# Altium schematic sheet ProgrammableGainAmplifier.SchDoc: Programmable Gain Amplifier
size A4; DrawnBy: Patrik Staudenmayer; DocumentNumber: 13; SheetNumber: 13; SheetTotal: 15
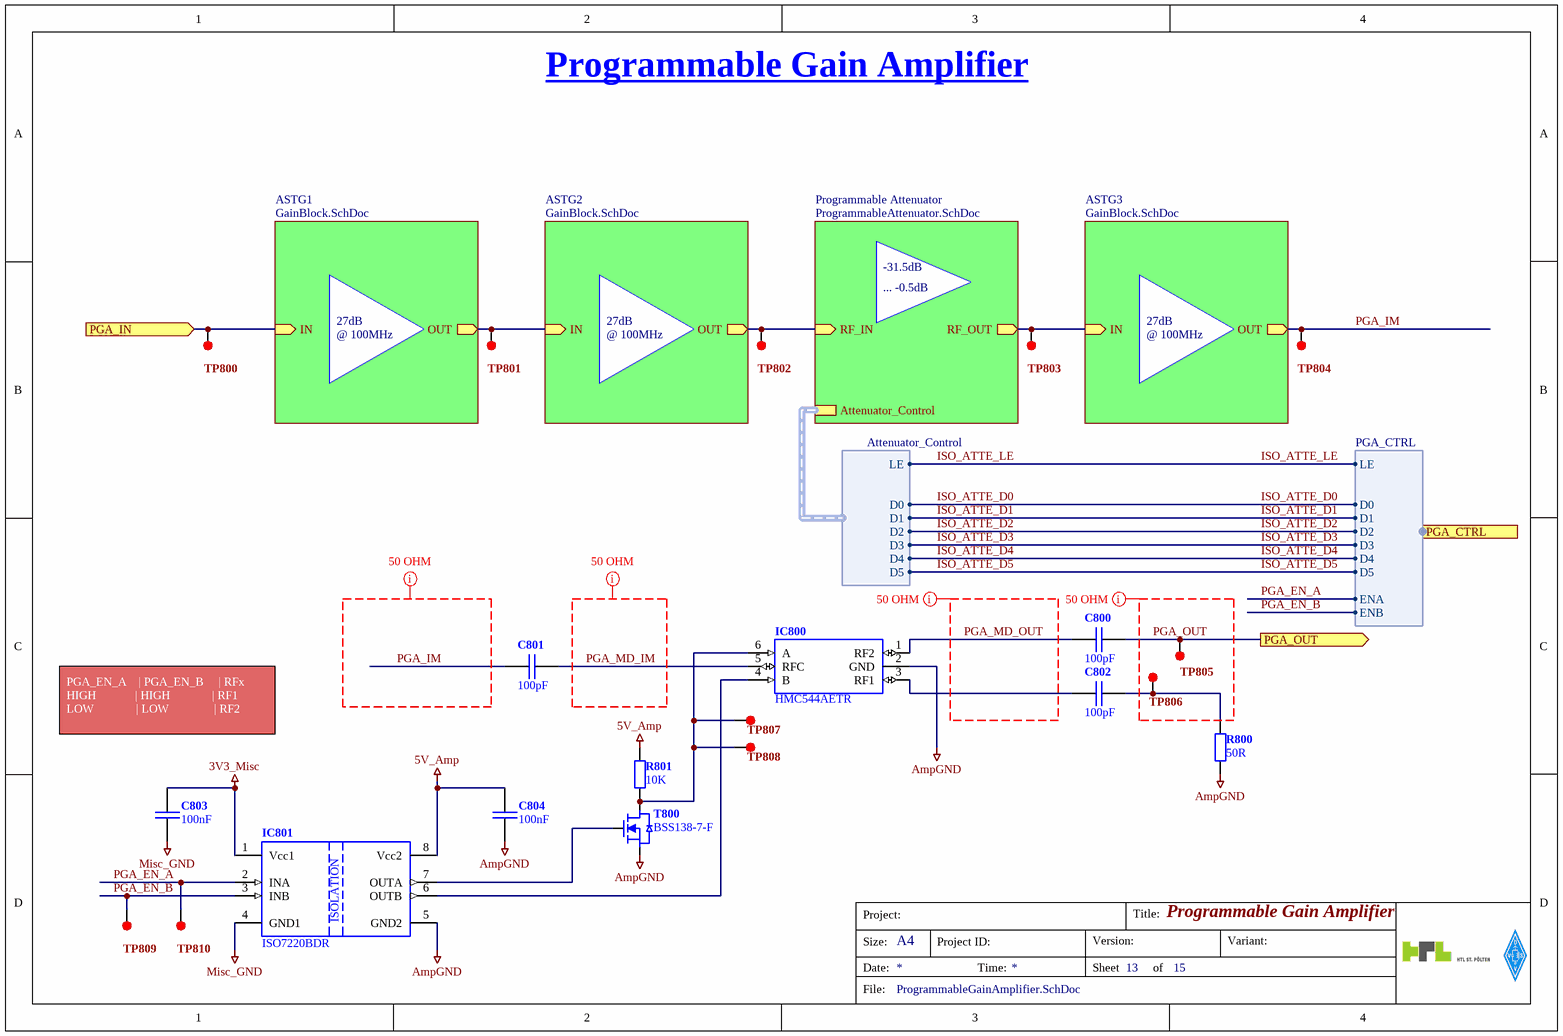
[diagram p0: ProgrammableGainAmplifier.SchDoc]

## Parts
C800  100pF  [C_0603_N [CAPC1608N IPC]]
C801  100pF  [C_0603_N [CAPC1608N IPC]]
C802  100pF  [C_0603_N [CAPC1608N IPC]]
C803  100nF  [C_0603_N [CAPC1608N IPC]]
C804  100nF  [C_0603_N [CAPC1608N IPC]]
IC800  HMC544AETR  [TSOP95P280X145-6N IPC]
IC801  ISO7220BDR  [SOIC127P600X175-8N IPC]
R800  50R  [R_1206_N [RESC3216N IPC]]
R801  10K  [R_0603_N [RESC1608N IPC]]
T800  BSS138-7-F  [SOT105P235X102-3N IPC]
TP800  TP_GENERIC  [TP_0.8_P100T]  (value not drawn)  (no BOM)
TP801  TP_GENERIC  [TP_0.8_P100T]  (value not drawn)  (no BOM)
TP802  TP_GENERIC  [TP_0.8_P100T]  (value not drawn)  (no BOM)
TP803  TP_GENERIC  [TP_0.8_P100T]  (value not drawn)  (no BOM)
TP804  TP_GENERIC  [TP_0.8_P100T]  (value not drawn)  (no BOM)
TP805  TP_GENERIC  [TP_0.8_P100T]  (value not drawn)  (no BOM)
TP806  TP_GENERIC  [TP_0.8_P100T]  (value not drawn)  (no BOM)
TP807  TP_GENERIC  [TP_0.8_P100T]  (value not drawn)  (no BOM)
TP808  TP_GENERIC  [TP_0.8_P100T]  (value not drawn)  (no BOM)
TP809  TP_GENERIC  [TP_0.8_P100T]  (value not drawn)  (no BOM)
TP810  TP_GENERIC  [TP_0.8_P100T]  (value not drawn)  (no BOM)

## Sub-sheets
ASTG1 = GainBlock.SchDoc: OUT (out), IN (in)
ASTG2 = GainBlock.SchDoc: OUT (out), IN (in)
ASTG3 = GainBlock.SchDoc: OUT (out), IN (in)
Programmable Attenuator = ProgrammableAttenuator.SchDoc: RF_IN (in), RF_OUT (out), Attenuator_Control (harness Attenuator_Control)

## Ports
PGA_CTRL (harness PGA_CTRL), PGA_IN (in), PGA_OUT (out)

## Harnesses
Attenuator_Control: LE, D0, D1, D2, D3, D4, D5
PGA_CTRL: LE, D0, D1, D2, D3, D4, D5, ENA, ENB

## Nets
3V3_Misc: C803.1 IC801.1(Vcc1)
5V_Amp: C804.1 IC801.8(Vcc2) R801.2
AmpGND: C804.2 IC800.2(GND) IC801.5(GND2) R800.1 T800.S
Misc_GND: C803.2 IC801.4(GND1)
ISO_ATTE_D0: sheet Programmable Attenuator/Attenuator_Control.D0, port PGA_CTRL.D0
ISO_ATTE_D1: sheet Programmable Attenuator/Attenuator_Control.D1, port PGA_CTRL.D1
ISO_ATTE_D2: sheet Programmable Attenuator/Attenuator_Control.D2, port PGA_CTRL.D2
ISO_ATTE_D3: sheet Programmable Attenuator/Attenuator_Control.D3, port PGA_CTRL.D3
ISO_ATTE_D4: sheet Programmable Attenuator/Attenuator_Control.D4, port PGA_CTRL.D4
ISO_ATTE_D5: sheet Programmable Attenuator/Attenuator_Control.D5, port PGA_CTRL.D5
ISO_ATTE_LE: sheet Programmable Attenuator/Attenuator_Control.LE, port PGA_CTRL.LE
PGA_EN_A: IC801.2(INA) TP810.1 ; port PGA_CTRL.ENA
PGA_EN_B: IC801.3(INB) TP809.1 ; port PGA_CTRL.ENB
PGA_IM: C801.1 TP804.1 ; sheet ASTG3/OUT
PGA_IN: TP800.1 ; port PGA_IN, sheet ASTG1/IN
PGA_MD_IM: C801.2 IC800.5(RFC)
PGA_MD_OUT: C800.1 IC800.1(RF2)
PGA_OUT: C800.2 TP805.1 ; port PGA_OUT
NetC802_1: C802.1 IC800.3(RF1)
NetC802_2: C802.2 R800.2 TP806.1
NetIC800_4: IC800.4(B) IC801.6(OUTB)
NetIC800_6: IC800.6(A) R801.1 T800.D TP807.1 TP808.1
NetIC801_7: IC801.7(OUTA) T800.G
NetTP801_1: TP801.1 ; sheet ASTG1/OUT, sheet ASTG2/IN
NetTP802_1: TP802.1 ; sheet ASTG2/OUT, sheet Programmable Attenuator/RF_IN
NetTP803_1: TP803.1 ; sheet ASTG3/IN, sheet Programmable Attenuator/RF_OUT

## Layout directives
rule Width Constraint [Pref Impedance = 50.00ohms    Min Impedance = 50.00ohms    Max Impedance = 50.00ohms]; rule Maximum Via Count Constraint [Max Count = 2]: PGA_IM, PGA_MD_IM, PGA_MD_OUT, PGA_OUT

## Notes on the sheet
- -31.5dB
- ... -0.5dB
- 27dB
- @ 100MHz
- PGA_EN_A    | PGA_EN_B     | RFx
  HIGH             | HIGH              | RF1
  LOW              | LOW               | RF2
- Project:
- Title:
- Size:
- Date:
- A4
- Project ID:
- Time:
- Sheet
- Version:
- of
- Variant:
- File:
- (in symbol IC_ISO7220BDR) ISOLATION

## Library data of the parts
C800-C802 = C_GENERIC: Prometheus_Manufacturer: AVX Corporation; Prometheus_ID: *; Prometheus_ManPartNo: =06031U101FAT2A; Prometheus_Comment: 100pF; Prometheus_CurrentFootprint: C_0603_N [CAPC1608N IPC]
C803 C804 = C_GENERIC: Prometheus_ID: *; Prometheus_ManPartNo: 100nF; Prometheus_Manufacturer: *; Prometheus_Comment: 100nF; Prometheus_CurrentFootprint: C_0603_N [CAPC1608N IPC]
IC800 = IC_HMC544AETR: GaAS MMIC T/R Switch / DC ... 4 GHz / Insetion Loss: 0.2 dB @ 1 GHz / P1dB: +39 dBm / IP3: +60 dBm / Control: 3 V / 5 V; Prometheus_Manufacturer: Analog Devices; Prometheus_ManPartNo: HMC544AETR; Prometheus_Comment: HMC544AETR; Prometheus_CurrentFootprint: TSOP95P280X145-6N IPC; DatasheetURL: https://www.analog.com/media/en/technical-documentation/data-sheets/hmc544ae.pdf
IC801 = IC_ISO7220BDR: Dual-Channel Digital Isolator / Vcc: 3V3 or 5 V Supply / 4 kV ESD protection; Prometheus_Manufacturer: Texas Instruments; Prometheus_ManPartNo: ISO7220BDR; Prometheus_Comment: ISO7220BDR; Prometheus_CurrentFootprint: SOIC127P600X175-8N IPC; DatasheetURL: https://www.ti.com/lit/ds/symlink/iso7220a.pdf
R800 R801 = R_GENERIC_DIN: Prometheus_ID: *; Prometheus_Manufacturer: *
  R800: Prometheus_ManPartNo: 50R; Prometheus_Comment: 50R; Prometheus_CurrentFootprint: R_1206_N [RESC3216N IPC]
  R801: Prometheus_ManPartNo: 10K; Prometheus_Comment: 10K; Prometheus_CurrentFootprint: R_0603_N [RESC1608N IPC]
T800 = T_NMOS_BSS138-7-F: VDS = 50 V / VDG = 50 V / VGS = +-20 V / ID = 200 mA / VGS_th = typ. 1.2 V / RDS_on = typ. 1.4 OHM; Prometheus_Manufacturer: Diodes Incorporated; Prometheus_ID: *; Prometheus_ManPartNo: BSS138-7-F; Prometheus_Comment: BSS138-7-F; Prometheus_CurrentFootprint: SOT105P235X102-3N IPC; ComponentLink1Description: Datasheet; ComponentLink1URL: https://www.diodes.com/assets/Datasheets/ds30144.pdf
TP800-TP810 = TP_GENERIC: Needle Test Point; Prometheus_ID: *; Prometheus_ManPartNo: TP_GENERIC; Prometheus_Manufacturer: *; Prometheus_Comment: TP_GENERIC; Prometheus_CurrentFootprint: TP_0.8_P100T